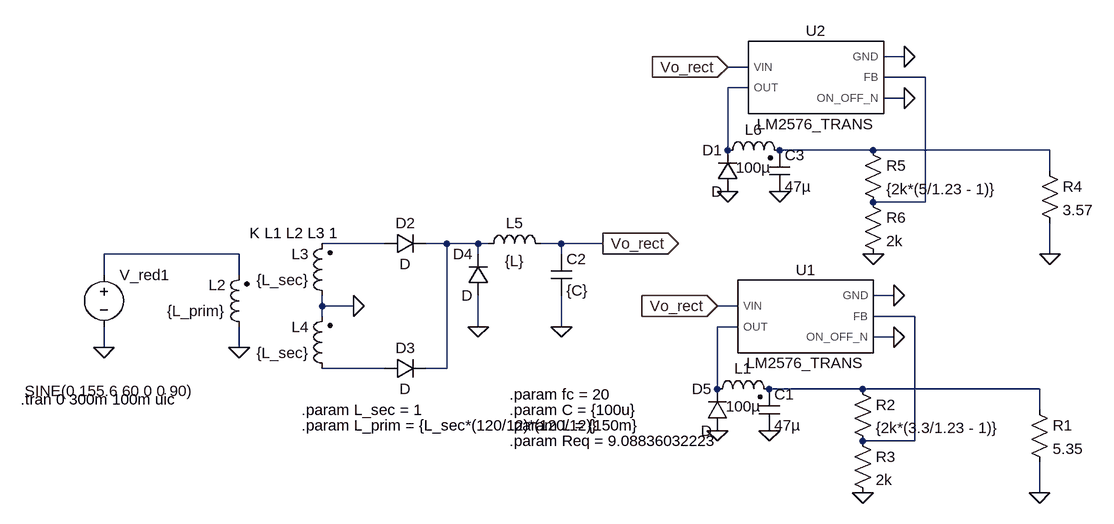
[diagram p0: schematic PowerModule.asc]
PowerModule.asc, the LTspice schematic file:
Version 4
SHEET 1 880 680
WIRE 272 -320 240 -320
WIRE 32 -304 0 -304
WIRE 304 -288 240 -288
WIRE 32 -272 0 -272
WIRE 272 -256 240 -256
WIRE 0 -176 0 -272
WIRE 224 -176 80 -176
WIRE 496 -176 224 -176
WIRE 496 -144 496 -176
WIRE 304 -96 304 -288
WIRE 304 -96 224 -96
WIRE -528 -32 -624 -32
WIRE -432 -32 -464 -32
WIRE -384 -32 -432 -32
WIRE -368 -32 -384 -32
WIRE -256 -32 -288 -32
WIRE -192 -32 -256 -32
WIRE -752 -16 -960 -16
WIRE -384 -16 -384 -32
WIRE -256 -16 -256 -32
WIRE 496 -16 496 -64
WIRE -960 16 -960 -16
WIRE -752 16 -752 -16
WIRE 256 48 224 48
WIRE -624 64 -624 48
WIRE -576 64 -624 64
WIRE 16 64 -16 64
WIRE -624 80 -624 64
WIRE 288 80 224 80
WIRE -384 96 -384 48
WIRE -256 96 -256 48
WIRE 16 96 -16 96
WIRE 256 112 224 112
WIRE -960 128 -960 96
WIRE -752 128 -752 96
WIRE -528 160 -624 160
WIRE -432 160 -432 -32
WIRE -432 160 -464 160
WIRE -16 192 -16 96
WIRE 208 192 64 192
WIRE 480 192 208 192
WIRE 480 224 480 192
WIRE 288 272 288 80
WIRE 288 272 208 272
WIRE 480 352 480 304
FLAG 256 48 0
FLAG 256 112 0
FLAG -16 256 0
FLAG 64 256 0
FLAG 208 352 0
FLAG 480 352 0
FLAG -960 128 0
FLAG -752 128 0
FLAG -576 64 0
FLAG -192 -32 Vo_rect
IOPIN -192 -32 Out
FLAG -256 96 0
FLAG -384 96 0
FLAG 272 -320 0
FLAG 272 -256 0
FLAG 0 -112 0
FLAG 80 -112 0
FLAG 224 -16 0
FLAG 496 -16 0
FLAG -16 64 Vo_rect
IOPIN -16 64 In
FLAG 0 -304 Vo_rect
IOPIN 0 -304 In
SYMBOL LM2576_TRANS 112 80 R0
SYMATTR InstName U1
SYMBOL ind2 -32 208 R270
WINDOW 0 32 56 VTop 2
WINDOW 3 5 56 VBottom 2
SYMATTR InstName L1
SYMATTR Value 100µ
SYMATTR Type ind
SYMBOL cap 48 192 R0
SYMATTR InstName C1
SYMATTR Value 47µ
SYMBOL res 464 208 R0
SYMATTR InstName R1
SYMATTR Value 5.35
SYMBOL res 192 176 R0
SYMATTR InstName R2
SYMATTR Value {2k*(3.3/1.23 - 1)}
SYMBOL res 192 256 R0
SYMATTR InstName R3
SYMATTR Value 2k
SYMBOL ind2 -736 112 R180
WINDOW 0 36 80 Left 2
WINDOW 3 36 40 Left 2
SYMATTR InstName L2
SYMATTR Value {L_prim}
SYMATTR SpiceLine Rser=1
SYMBOL voltage -960 0 R0
WINDOW 3 -122 195 Left 2
WINDOW 123 0 0 Left 0
WINDOW 39 0 0 Left 0
SYMATTR Value SINE(0 155.6 60 0 0 90)
SYMATTR InstName V_red1
SYMBOL cap -272 -16 R0
SYMATTR InstName C2
SYMATTR Value {C}
SYMBOL ind2 -608 64 R180
WINDOW 0 36 80 Left 2
WINDOW 3 36 40 Left 2
SYMATTR InstName L3
SYMATTR Value {L_sec}
SYMBOL ind2 -608 176 R180
WINDOW 0 36 80 Left 2
WINDOW 3 36 40 Left 2
SYMATTR InstName L4
SYMATTR Value {L_sec}
SYMBOL ind -384 -16 R270
WINDOW 0 32 56 VTop 2
WINDOW 3 5 56 VBottom 2
SYMATTR InstName L5
SYMATTR Value {L}
SYMATTR SpiceLine Rser=0.4
SYMBOL LM2576_TRANS 128 -288 R0
SYMATTR InstName U2
SYMBOL ind2 -16 -160 R270
WINDOW 0 32 56 VTop 2
WINDOW 3 5 56 VBottom 2
SYMATTR InstName L6
SYMATTR Value 100µ
SYMATTR Type ind
SYMBOL cap 64 -176 R0
SYMATTR InstName C3
SYMATTR Value 47µ
SYMBOL res 480 -160 R0
SYMATTR InstName R4
SYMATTR Value 3.57
SYMBOL res 208 -192 R0
SYMATTR InstName R5
SYMATTR Value {2k*(5/1.23 - 1)}
SYMBOL res 208 -112 R0
SYMATTR InstName R6
SYMATTR Value 2k
SYMBOL diode -528 -16 R270
WINDOW 0 32 32 VTop 2
WINDOW 3 0 32 VBottom 2
SYMATTR InstName D2
SYMBOL diode -528 176 R270
WINDOW 0 32 32 VTop 2
WINDOW 3 0 32 VBottom 2
SYMATTR InstName D3
SYMBOL diode -368 48 R180
WINDOW 0 24 64 Left 2
WINDOW 3 24 0 Left 2
SYMATTR InstName D4
SYMBOL diode 16 -112 R180
WINDOW 0 24 64 Left 2
WINDOW 3 24 0 Left 2
SYMATTR InstName D1
SYMBOL diode 0 256 R180
WINDOW 0 24 64 Left 2
WINDOW 3 24 0 Left 2
SYMATTR InstName D5
TEXT -736 -48 Left 2 !K L1 L2 L3 1
TEXT -1088 208 Left 2 !.tran 0 300m 100m uic
TEXT -336 224 Left 2 !.param C = {100u}
TEXT -336 248 Left 2 !.param L = {150m}
TEXT -336 200 Left 2 !.param fc = 20
TEXT -656 224 Left 2 !.param L_sec = 1
TEXT -656 248 Left 2 !.param L_prim = {L_sec*(120/12)*(120/12)}
TEXT -336 272 Left 2 !.param Req = 9.08836032223

The netlist it stands for:
* PowerModule.asc
XU1 Vo_rect N008 0 N007 0 LM2576_TRANS  ; pins VIN OUT GND FB ON_OFF_N
L1 N008 N010 100µ
C1 N010 0 47µ
R1 N010 0 5.35
R2 N010 N007 {2k*(3.3/1.23 - 1)}
R3 N007 0 2k
L2 0 N006 {L_prim} Rser=1
V_red1 N006 0 SINE(0 155.6 60 0 0 90)
C2 Vo_rect 0 {C}
L3 0 N004 {L_sec}
L4 N009 0 {L_sec}
L5 N005 Vo_rect {L} Rser=0.4
XU2 Vo_rect N002 0 N001 0 LM2576_TRANS  ; pins VIN OUT GND FB ON_OFF_N
L6 N002 N003 100µ
C3 N003 0 47µ
R4 N003 0 3.57
R5 N003 N001 {2k*(5/1.23 - 1)}
R6 N001 0 2k
D2 N004 N005 D
D3 N009 N005 D
D4 0 N005 D
D1 0 N002 D
D5 0 N008 D
.model D D
.lib standard.dio
K L1 L2 L3 1
.tran 0 300m 100m uic
.param C = {100u}
.param L = {150m}
.param fc = 20
.param L_sec = 1
.param L_prim = {L_sec*(120/12)*(120/12)}
.param Req = 9.08836032223
.lib C:\users\omar\My Documents\University\IX_Semester\Disenio\Easyrun\Circuit Design\LTspice Simulations\LM2576_TRANS.LIB
.backanno
.end